# EAGLE design Copperclad_CooperBuffer_Amp_V0-6 (EAGLE 7.5.0)
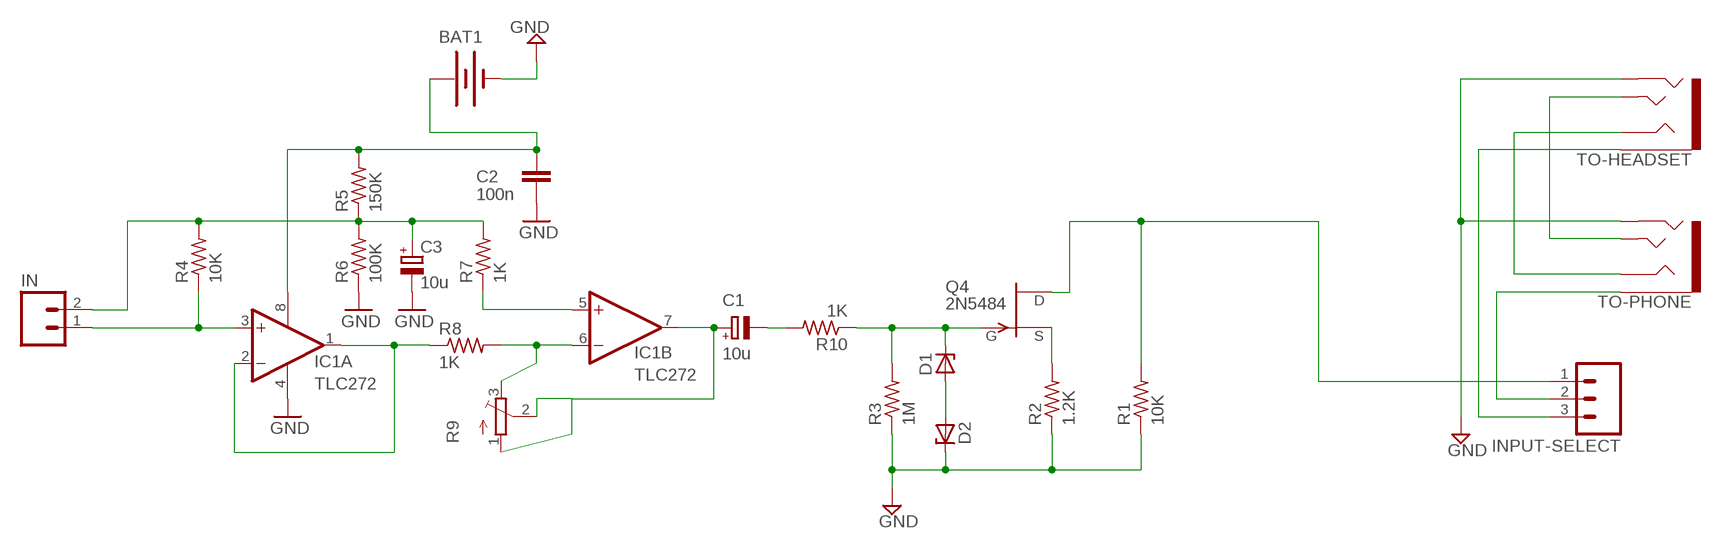
[diagram p0: schematic, sheet 1]

## Parts
BAT1  BATTERYA23  [BATTERY-A23]
C1  10u  CPOL-EUE2.5-5  [E2,5-5]
C2  100n  C-EU025-025X050  [C025-025X050]
C3  10u  CPOL-EUE2.5-5  [E2,5-5]
D1  1N821  [DO35Z10]
D2  1N821  [DO35Z10]
IC1  TLC272  TLC272P  [DIL08]
IN  M02LOCK  [1X02_LOCK]
INPUT-SELECT  M03LOCK  [1X03_LOCK]
Q4  2N5484  [TO92-]
R1  10K  R-US_0204/2V  [0204V]
R2  1.2K  R-US_0204/2V  [0204V]
R3  1M  R-US_0204/2V  [0204V]
R4  10K  R-US_0204/2V  [0204V]
R5  150K  R-US_0204/2V  [0204V]
R6  100K  R-US_0204/2V  [0204V]
R7  1K  R-US_0204/2V  [0204V]
R8  1K  R-US_0204/2V  [0204V]
R9  TRIMPOT3386  [TRIM-3386]
R10  1K  R-US_0204/2V  [0204V]
TO-HEADSET  AUDIO-JACK3  [AUDIO-JACK-TRRS-SMD]
TO-PHONE  AUDIO-JACK3  [AUDIO-JACK-TRRS-SMD]

## Nets
`DEL: INPUT-SELECT.1 Q4.3(D) R1.2
GND: BAT1.GND@1(-) C2.1 C3.- D2.C IC1.4(P:V-) R1.1 R2.1 R3.1 R6.1 TO-HEADSET.RING2 TO-PHONE.RING2
N$1: D1.A D2.A
N$3: Q4.2(S) R2.2
N$5: IC1.5(B:+IN) R7.1
N$6: C1.+ IC1.7(B:OUT) R9.1(A) R9.2(S)
N$7: IC1.6(B:-IN) R8.2 R9.3(E)
N$8: C3.+ IN.2 R4.2 R5.1 R6.2 R7.2
N$9: IC1.3(A:+IN) IN.1 R4.1
N$10: D1.C Q4.1(G) R3.2 R10.1
N$11: C1.- R10.2
N$12: INPUT-SELECT.3 TO-HEADSET.EARTH
N$13: TO-HEADSET.TIP TO-PHONE.TIP
N$14: IC1.1(A:OUT) IC1.2(A:-IN) R8.1
N$15: TO-HEADSET.RING1 TO-PHONE.RING1
TO-PHONE: INPUT-SELECT.2 TO-PHONE.EARTH
V9V: BAT1.PWR@1(+) C2.2 IC1.8(P:V+) R5.2

## Library data of the parts
BAT1 = Daniel:BATTERY: Battery Holders Various common sizes : AA, AAA, 18650 (PRT-12895), 20mm coin cell and 12mm coin cell. 20MM_4LEGS, BATT-10373
C1 C3 = rcl:CPOL-EU: POLARIZED CAPACITOR, European symbol
C2 = rcl:C-EU: CAPACITOR, European symbol
D1 D2 = diode:1N821: Reference DIODE temperature compensated, 6,2 V
IC1 = linear:TLC272: OP AMP
IN = SparkFun-Connectors:M02: Header 2 Standard 2-pin 0.1" header. Use with straight break away headers (SKU : PRT-00116), right angle break away headers (PRT-00553), swiss pins (PRT-00743), machine pins (PRT-00117), and female headers (PRT-00115). Molex polarized connector foot print use with SKU : PRT-08233 with associated crimp pins and housings.
INPUT-SELECT = SparkFun-Connectors:M03: Header 3 Standard 3-pin 0.1" header. Use with straight break away headers (SKU : PRT-00116), right angle break away headers (PRT-00553), swiss pins (PRT-00743), machine pins (PRT-00117), and female headers (PRT-00115). Molex polarized connector foot print use with SKU : PRT-08232 with associated crimp pins and housings.
Q4 = transistor-fet:?548*: N-Channel JFETs Source: VISHAY 2N5484.pdf Compatible: TO92 2N5245 J304 J305 U310 J308 J309 J310 TO72 2N4416 2N4416A 2N3823 2N4351 3N169 3N170 3N171 MFE3002 TO18 2N3796 2N3797 MFE825 Source: Motorola European Master Guide Pacge 3-59
R1-R8 R10 = resistor:R-US_: RESISTOR, American symbol
R9 = adafruit:TRIMPOT: SMT trimmer potentiometer part number TC33X http://www.ladyada.net/library/eagle
TO-HEADSET TO-PHONE = SparkFun-Connectors:AUDIO-JACK3: Audio jack - 3.5mm TRRS variety - two rings.

## Net classes
0 default: width 0.6 mm, clearance 0.2 mm

## Board
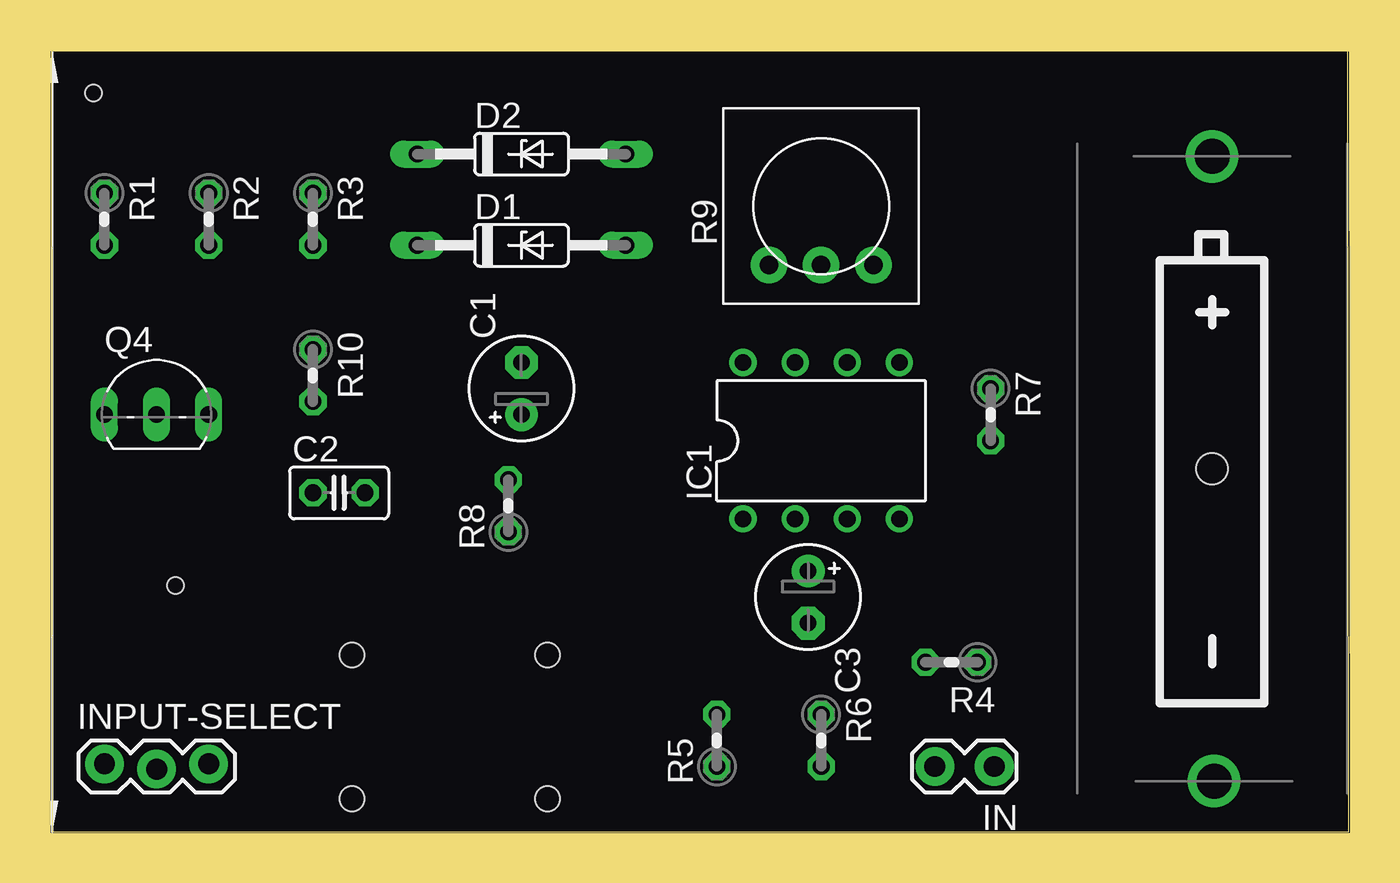
[diagram p1: board, top side]
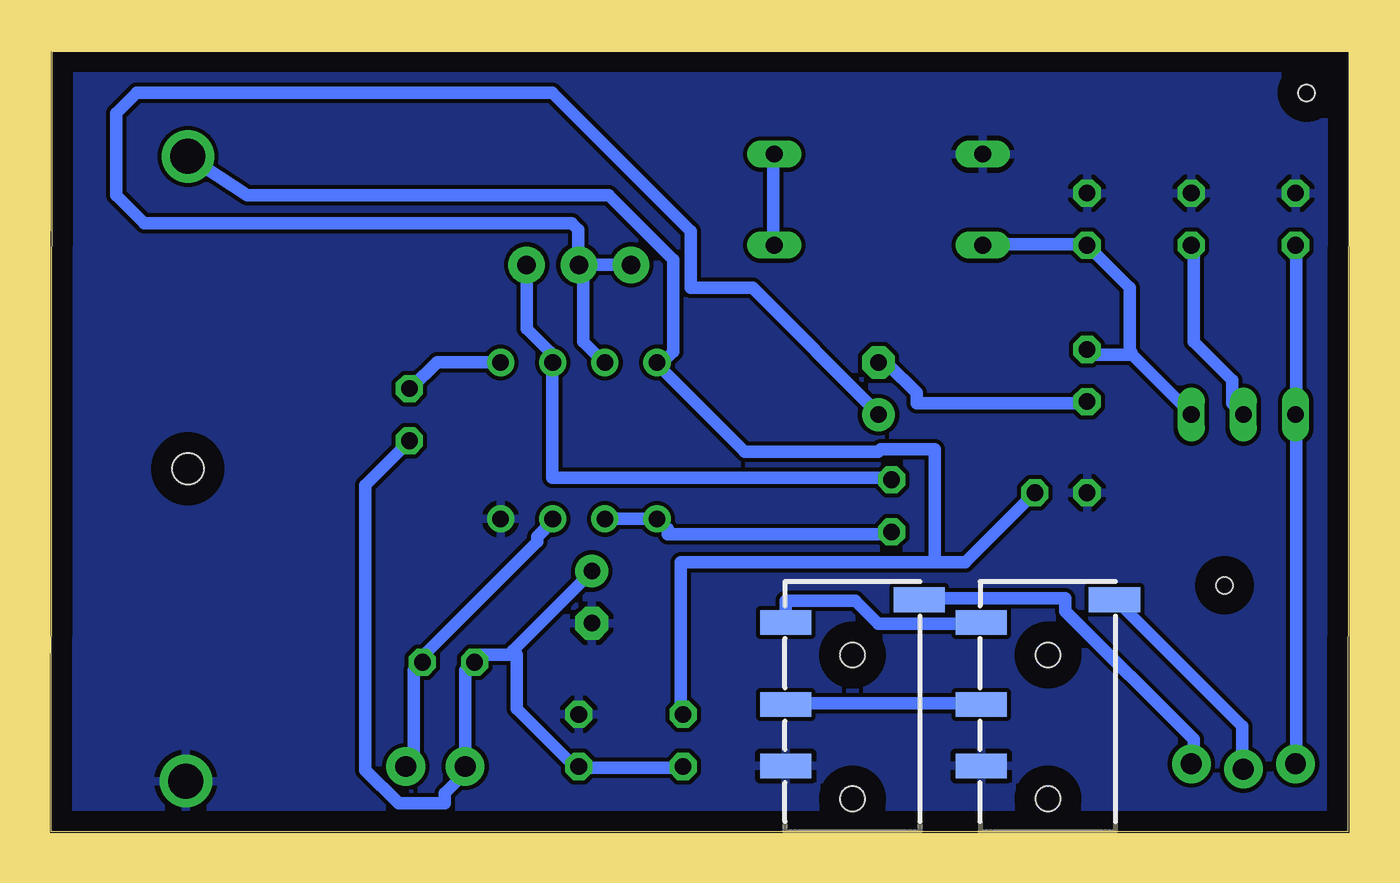
[diagram p2: board, bottom side, seen from below]

Size 63.22 x 38.02 mm. Coordinates in mm from the lower left corner, seen from the top.
Outline: 0.05,0 63.22,0 63.17,38.02 0,38.02 0.05,0
Copper layers (1*16): Top 0.035mm / dielectric 1.5mm / Bottom 0.035mm
Design rules "default *": minimum track width 10mil, minimum drill 24mil, track to track 8mil, track to pad 8mil, pad to pad 8mil, via to via 8mil, smd to smd 8mil, copper to edge 40mil, drill to drill 8mil, minimum pad ring 10mil, minimum via ring 8mil, stop-mask expansion 4mil, vias tented up to drill 0mil, thermal gap 10mil
Holes 0.8 mm at 2.05,36 6.05,12
Milling: 4 lines

### Footprints (pad centres in the part's own frame; a part is rotated, then mirrored left to right if it is on the bottom)
BATTERY-A23 = drill 1.702: GND@1 15.22,0.1; PWR@1 -15.22,0 | hole 1.524: 0,0
E2,5-5 = drill 0.813 pad 1.6: + -1.27,0 | drill 0.813 pad 1.6 octagon: - 1.27,0
C025-025X050 = drill 0.813 octagon: 1 -1.27,0; 2 1.27,0
DO35Z10 = drill 0.813 long: A 5.08,0; C -5.08,0
DIL08 = drill 0.813 pad 1.27: 1 -3.81,-3.81; 2 -1.27,-3.81; 3 1.27,-3.81; 4 3.81,-3.81; 5 3.81,3.81; 6 1.27,3.81; 7 -1.27,3.81; 8 -3.81,3.81
1X02_LOCK = drill 1.016 pad 1.88: 1 -0.178,0; 2 2.718,0
1X03_LOCK = drill 1.016 pad 1.88: 1 0,0.127; 2 2.54,-0.127; 3 5.08,0.127
TO92- = drill 0.813 long: 1 2.54,0; 2 0,0; 3 -2.54,0
0204V = drill 0.813 octagon: 1 -1.27,0; 2 1.27,0
TRIM-3386 = drill 0.9 pad 1.778: 1 -2.54,-2.857; 2 0,-2.857; 3 2.54,-2.857
AUDIO-JACK-TRRS-SMD = smd 1.2 x 2.5: EARTH 11.3,-3.25; RING1 6.2,3.25; RING2 3.2,3.25; TIP 10.2,3.25 | hole 1.2: 1.6,0; 8.6,0

### Placement (x,y rotation side)
BAT1  56.56,17.68 270 top
C1  22.91,21.59 90 top
C2  14.02,16.51 0 top
C3  36.88,11.43 270 top
D1  22.91,28.57 0 top
D2  22.91,33.02 0 top
IC1  37.52,19.05 0 top
IN  45.77,3.17 180 top
INPUT-SELECT  2.59,3.17 0 top
Q4  5.13,20.32 0 top
R1  2.59,29.84 270 top
R2  7.67,29.84 270 top
R3  12.75,29.84 270 top
R4  43.86,8.26 180 top
R5  32.43,4.45 90 top
R6  37.52,4.45 270 top
R7  45.77,20.32 270 top
R8  22.28,15.88 90 top
R9  37.52,30.48 0 top
R10  12.75,22.23 270 top
TO-HEADSET  24.18,0 90 bottom
TO-PHONE  14.66,0 90 bottom

### Tracks (layer width: path | path; a pad name or v marks a point on that pad's centre or on a via)
_OUTLINES_
  pour Bottom (isolate 0.001, rank 6): -0.34,-2.13 63.75,-2.13 63.75,43.32 -0.34,43.32
`DEL
  Bottom 0.6: R1.2 2.55,28.5 2.55,20.38 Q4.3 2.55,20.12 2.55,3.38 INPUT-SELECT.1
GND
  pour Bottom: 0.05,39.37 63.55,39.37 63.55,0 0.05,0
N$1
  Bottom 0.6: D1.A 28.05,28.62 28.05,33 D2.A
N$3
  Bottom 0.6: Q4.2 5.17,20.38 5.67,20.88 5.67,22 7.55,23.88 7.55,28.5 R2.2
N$5
  Bottom 0.6: R7.1 45.67,21.62 44.42,22.88 41.42,22.88 IC1.5
N$6
  Bottom 0.6: C1.+ 22.93,20.38 29.05,26.5 32.05,26.5 32.05,29.25 38.8,36 59.05,36 60.05,35 60.05,31 58.69,29.64 37.86,29.64 37.55,29.33 37.55,27.62 R9.2 | IC1.7 36.3,22.88 37.3,23.88 37.3,27.5 R9.2 | R9.1 35.05,27.62 37.05,27.62 R9.2
N$7
  Bottom 0.6: R8.2 22.3,17.25 38.8,17.25 38.8,22.75 IC1.6 38.92,23.12 38.92,23.38 40.05,24.5 40.05,27.5 R9.3
N$8
  Bottom 0.6: R5.1 32.55,3.12 37.42,3.12 R6.2 37.8,3.25 40.55,6 40.55,8.62 40.74,8.81 | 40.74,8.81 40.92,8.62 42.42,8.62 42.42,8.5 R4.2 42.67,8.25 43.05,7.88 43.05,3.25 IN.2 43.05,2.88 44.05,1.88 44.05,1.38 46.3,1.38 47.92,3 47.92,16.88 45.8,19 R7.2 | 40.74,8.81 36.92,12.62 C3.+
N$9
  Bottom 0.6: IN.1 45.92,3.25 45.55,3.62 45.55,7.88 45.17,8.25 R4.1 45.05,8.5 45.05,8.62 39.55,14.12 39.55,14.38 38.8,15.12 IC1.3
N$10
  Bottom 0.6: 10.55,23.25 7.67,20.38 Q4.1 | 10.55,23.25 12.68,23.25 12.68,23.38 R10.1 | 10.55,23.25 10.68,23.5 10.68,26.5 R3.2 12.93,28.62 17.8,28.62 D1.C
N$11
  Bottom 0.6: R10.2 12.8,20.88 21.05,20.88 21.05,21.38 22.43,22.75 22.8,22.75 C1.-
N$12
  Bottom 0.6: TO-HEADSET.EARTH 20.93,11.38 13.8,11.38 13.8,10.75 7.55,4.5 7.55,3.38 INPUT-SELECT.3
N$13
  Bottom 0.6: TO-PHONE.TIP 17.93,10.12 22.93,10.12 24.05,11.25 27.43,11.25 27.43,10.25 TO-HEADSET.TIP
N$14
  Bottom 0.6: R8.1 22.3,14.5 33.17,14.5 33.17,14.75 33.67,15.25 IC1.1 33.92,15.25 36.17,15.25 IC1.2
N$15
  Bottom 0.6: TO-PHONE.RING1 17.93,6.25 27.43,6.25 TO-HEADSET.RING1
TO-PHONE
  Bottom 0.6: TO-PHONE.EARTH 11.3,11.25 5.17,5.12 5.17,3.12 INPUT-SELECT.2
V9V
  Bottom 0.6: C2.2 18.68,13.12 20.18,13.12 | 20.18,13.12 32.55,13.12 32.55,5.75 R5.2 | 20.18,13.12 20.18,18.62 22.8,18.62 22.93,18.5 29.43,18.5 33.67,22.75 IC1.8 33.42,22.88 32.92,23.38 32.92,27.88 36.05,31 53.66,31 BAT1.PWR@1